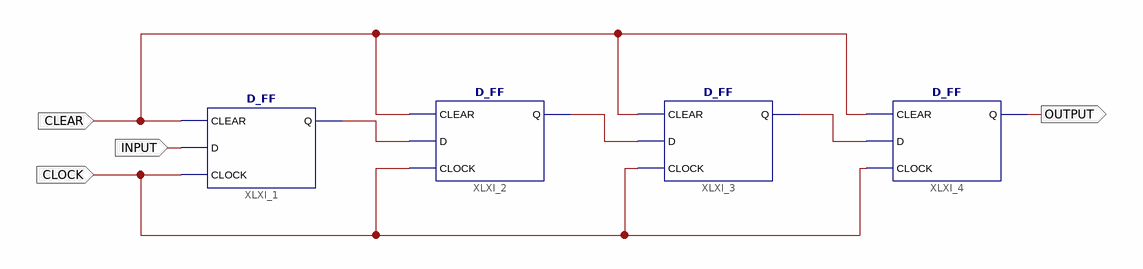
[diagram p0: schematic sheet 1]
// Xilinx ISE schematic SISO.sch (artix7) as structural Verilog: 4 symbols, 4 ports
module SISO (
  input  CLEAR,
  input  CLOCK,
  input  INPUT,
  output OUTPUT
);

  wire XLXN_9, XLXN_10, XLXN_11;

  D_FF XLXI_1 (.CLEAR(CLEAR), .CLOCK(CLOCK), .D(INPUT), .Q(XLXN_9));
  D_FF XLXI_2 (.CLEAR(CLEAR), .CLOCK(CLOCK), .D(XLXN_9), .Q(XLXN_10));
  D_FF XLXI_3 (.CLEAR(CLEAR), .CLOCK(CLOCK), .D(XLXN_10), .Q(XLXN_11));
  D_FF XLXI_4 (.CLEAR(CLEAR), .CLOCK(CLOCK), .D(XLXN_11), .Q(OUTPUT));
endmodule
